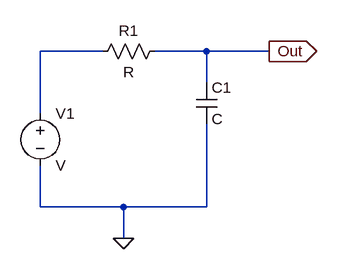
[diagram p0: schematic 25.1_3.rev-1.asc]
25.1_3.rev-1.asc, the LTspice schematic file:
Version 4
SHEET 1 880 680
WIRE 16 96 -80 96
WIRE 176 96 96 96
WIRE 272 96 176 96
WIRE 176 144 176 96
WIRE -80 192 -80 96
WIRE -80 336 -80 272
WIRE 48 336 -80 336
WIRE 176 336 176 208
WIRE 176 336 48 336
WIRE 48 384 48 336
FLAG 48 384 0
FLAG 272 96 Out
IOPIN 272 96 Out
SYMBOL cap 160 144 R0
SYMATTR InstName C1
SYMBOL res 112 80 R90
WINDOW 0 0 56 VBottom 2
WINDOW 3 32 56 VTop 2
SYMATTR InstName R1
SYMBOL voltage -80 176 R0
SYMATTR InstName V1

The netlist it stands for:
* 25.1_3.rev-1.asc
C1 Out 0 C
R1 Out N001 R
V1 N001 0 V
.backanno
.end